# Altium schematic sheet eMMC.SchDoc
size 420 x 297 mm; SheetNumber: 14; SheetTotal: 34
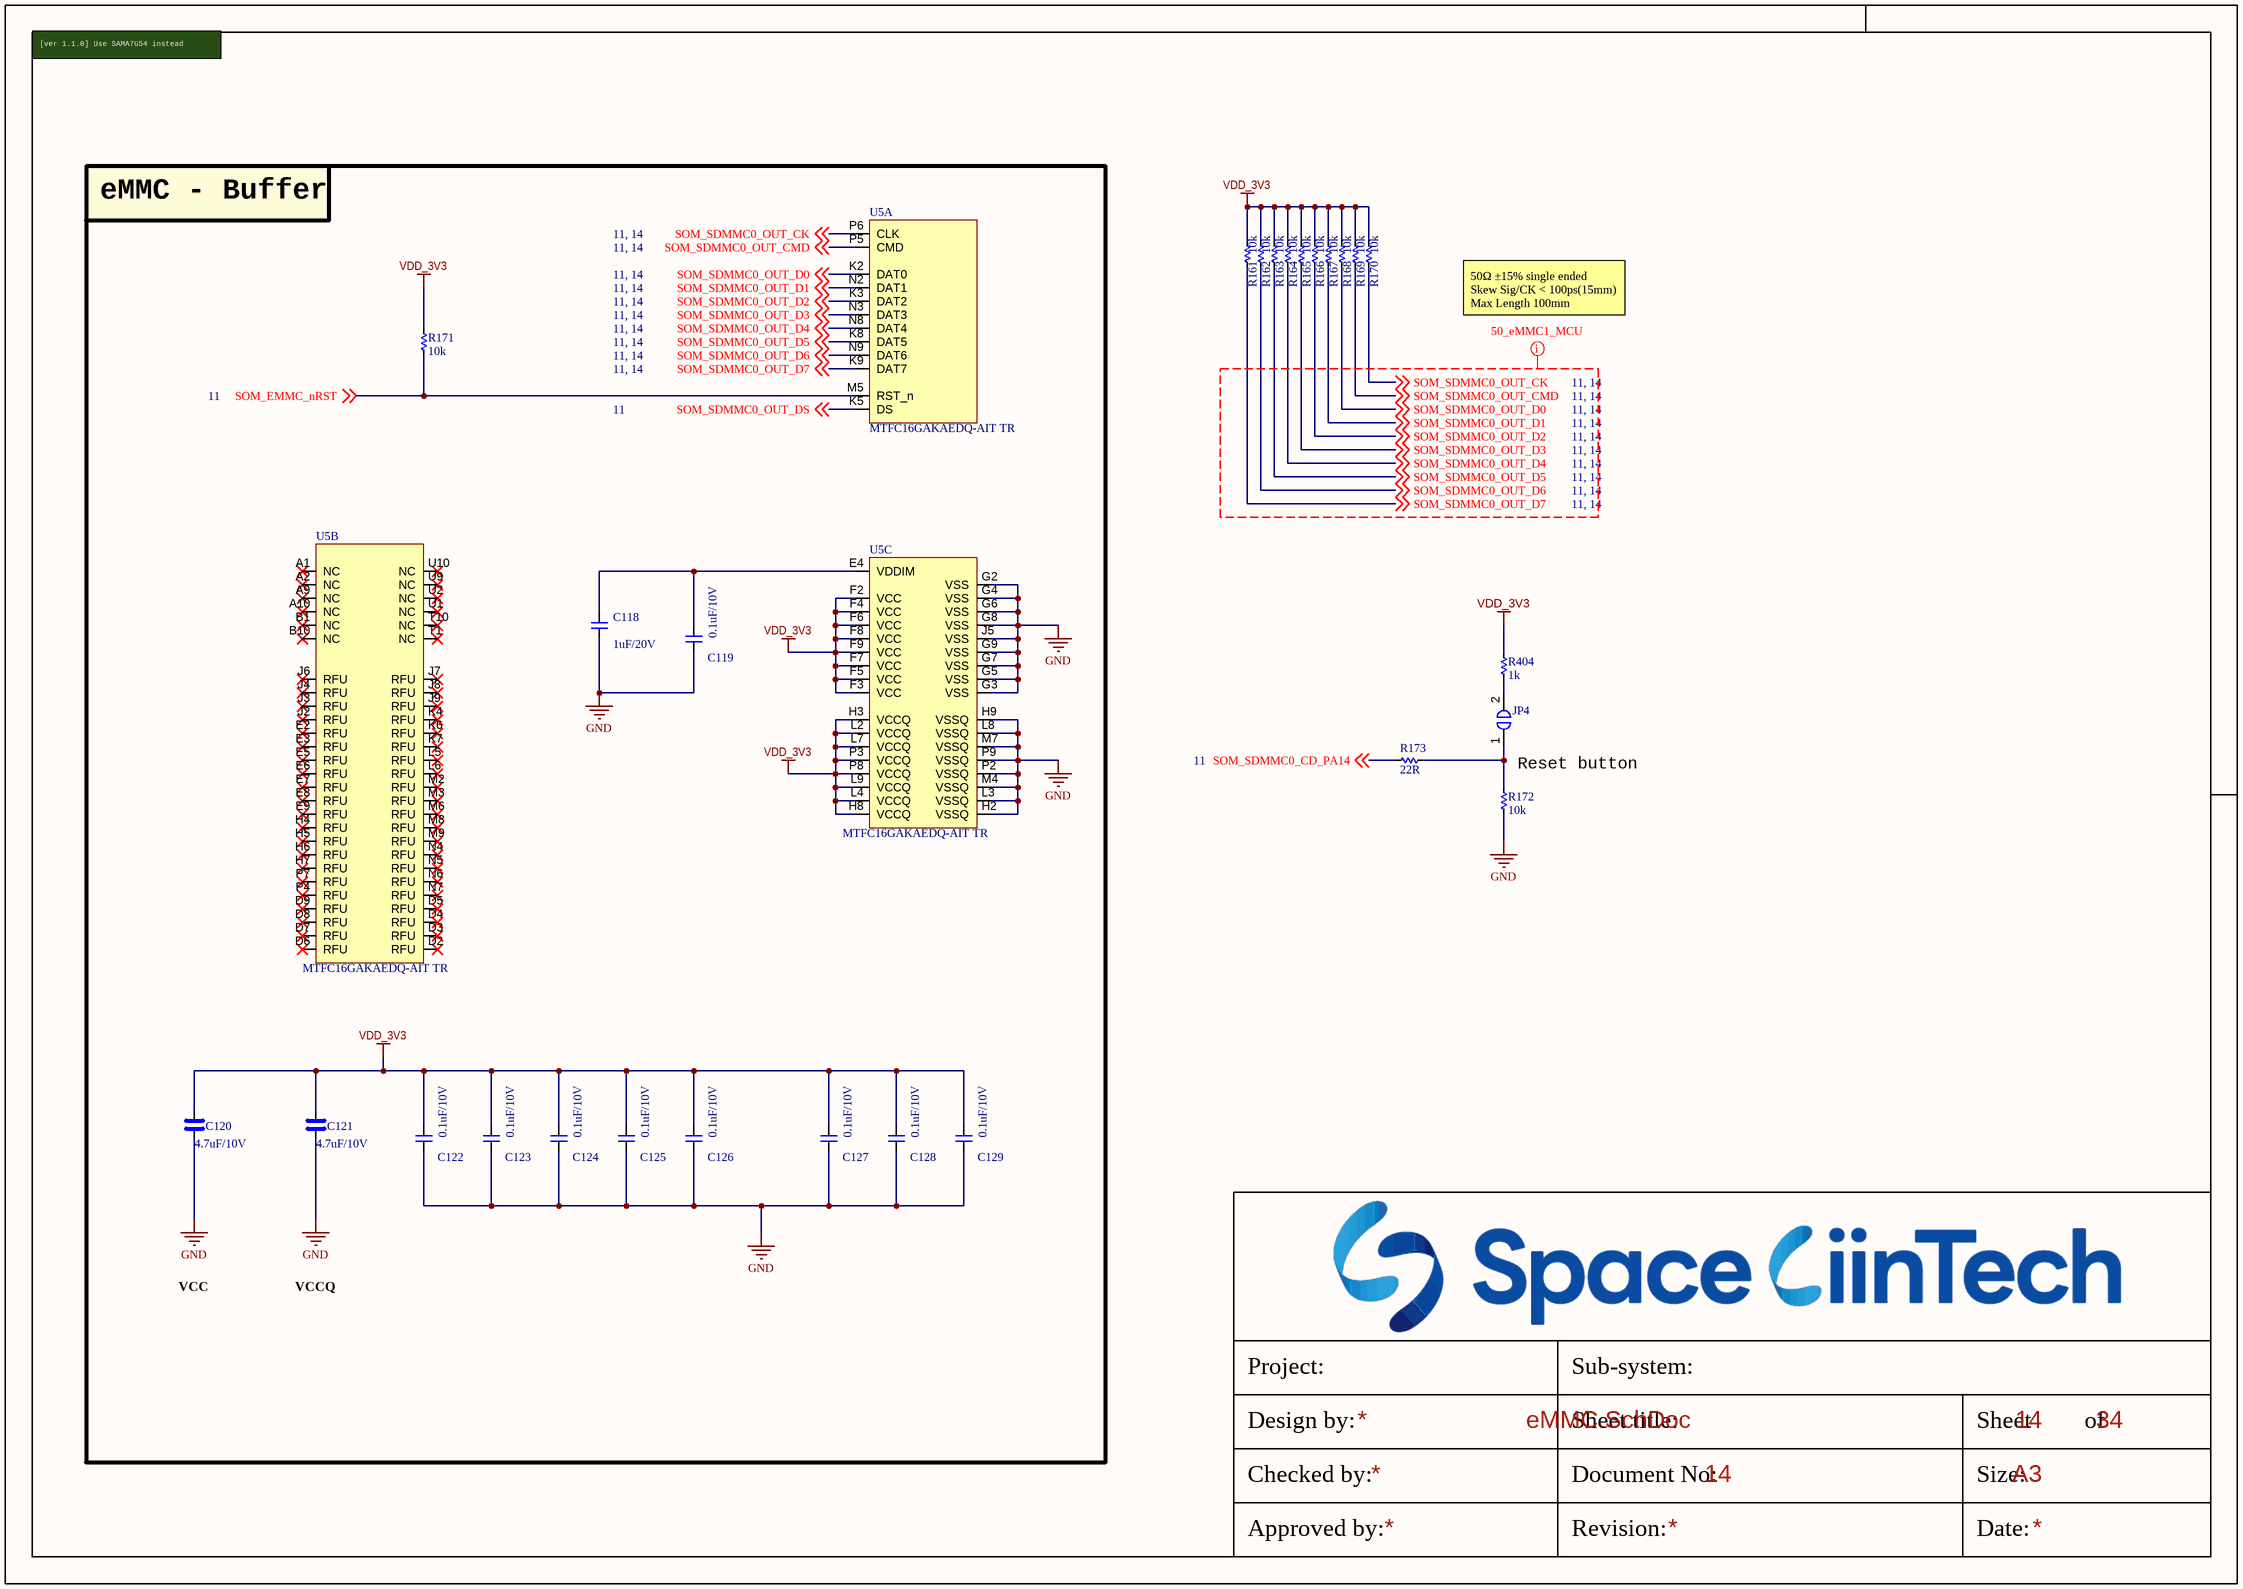
[diagram p0: eMMC.SchDoc]

## Parts
C118  1uF/20V  [CAP_C_1005X50_L]
C119  0.1uF/10V  [CAP_C_1005X50_L]
C120  4.7uF/10V  [CAP_C_1005X50_L]
C121  4.7uF/10V  [CAP_C_1005X50_L]
C122  0.1uF/10V  [CAP_C_1005X50_L]
C123  0.1uF/10V  [CAP_C_1005X50_L]
C124  0.1uF/10V  [CAP_C_1005X50_L]
C125  0.1uF/10V  [CAP_C_1005X50_L]
C126  0.1uF/10V  [CAP_C_1005X50_L]
C127  0.1uF/10V  [CAP_C_1005X50_L]
C128  0.1uF/10V  [CAP_C_1005X50_L]
C129  0.1uF/10V  [CAP_C_1005X50_L]
JP4  (no value)  [JUMPER_1608]
R161  10k  [RES_C_1005x30_L]
R162  10k  [RES_C_1005x30_L]
R163  10k  [RES_C_1005x30_L]
R164  10k  [RES_C_1005x30_L]
R165  10k  [RES_C_1005x30_L]
R166  10k  [RES_C_1005x30_L]
R167  10k  [RES_C_1005x30_L]
R168  10k  [RES_C_1005x30_L]
R169  10k  [RES_C_1005x30_L]
R170  10k  [RES_C_1005x30_L]
R171  10k  [RES_C_1005x30_L]
R172  10k  [RES_C_1005x30_L]
R173  22R  [RES_C_1005x30_L]
R404  1k  [RES_C_1005x30_L]
U5  MTFC16GAKAEDQ-AIT TR  [BGA_100_C_100P_10X17_1400X1800X150]  (parts A,B,C of 3)

## Blocks framed on the sheet
eMMC - Buffer: C118-C129 R171 U5

## Nets
GND: C118.1 C119.1 C120.1 C121.1 C122.1 C123.1 C124.1 C125.1 C126.1 C127.1 C128.1 C129.1 R172.1 U5.G2(VSS) U5.G3(VSS) U5.G4(VSS) U5.G5(VSS) U5.G6(VSS) U5.G7(VSS) U5.G8(VSS) U5.G9(VSS) U5.H2(VSSQ) U5.H9(VSSQ) U5.J5(VSS) U5.L3(VSSQ) U5.L8(VSSQ) U5.M4(VSSQ) U5.M7(VSSQ) U5.P2(VSSQ) U5.P9(VSSQ)
VDD_3V3: C120.2 C121.2 C122.2 C123.2 C124.2 C125.2 C126.2 C127.2 C128.2 C129.2 R161.2 R162.2 R163.2 R164.2 R165.2 R166.2 R167.2 R168.2 R169.2 R170.2 R171.2 R404.2 U5.F2(VCC) U5.F3(VCC) U5.F4(VCC) U5.F5(VCC) U5.F6(VCC) U5.F7(VCC) U5.F8(VCC) U5.F9(VCC) U5.H3(VCCQ) U5.H8(VCCQ) U5.L2(VCCQ) U5.L4(VCCQ) U5.L7(VCCQ) U5.L9(VCCQ) U5.P3(VCCQ) U5.P8(VCCQ)
SOM_EMMC_nRST: R171.1 U5.M5(RST_n) ; off-sheet SOM_EMMC_nRST
SOM_SDMMC0_CD_PA14: R173.1 ; off-sheet SOM_SDMMC0_CD_PA14
SOM_SDMMC0_OUT_CK: R170.1 U5.P6(CLK) ; off-sheet SOM_SDMMC0_OUT_CK
SOM_SDMMC0_OUT_CMD: R169.1 U5.P5(CMD) ; off-sheet SOM_SDMMC0_OUT_CMD
SOM_SDMMC0_OUT_D0: R168.1 U5.K2(DAT0) ; off-sheet SOM_SDMMC0_OUT_D0
SOM_SDMMC0_OUT_D1: R167.1 U5.N2(DAT1) ; off-sheet SOM_SDMMC0_OUT_D1
SOM_SDMMC0_OUT_D2: R166.1 U5.K3(DAT2) ; off-sheet SOM_SDMMC0_OUT_D2
SOM_SDMMC0_OUT_D3: R165.1 U5.N3(DAT3) ; off-sheet SOM_SDMMC0_OUT_D3
SOM_SDMMC0_OUT_D4: R164.1 U5.N8(DAT4) ; off-sheet SOM_SDMMC0_OUT_D4
SOM_SDMMC0_OUT_D5: R163.1 U5.K8(DAT5) ; off-sheet SOM_SDMMC0_OUT_D5
SOM_SDMMC0_OUT_D6: R162.1 U5.N9(DAT6) ; off-sheet SOM_SDMMC0_OUT_D6
SOM_SDMMC0_OUT_D7: R161.1 U5.K9(DAT7) ; off-sheet SOM_SDMMC0_OUT_D7
SOM_SDMMC0_OUT_DS: U5.K5(DS) ; off-sheet SOM_SDMMC0_OUT_DS
NetC118_2: C118.2 C119.2 U5.E4(VDDIM)
NetJP4_1: JP4.1 R172.2 R173.2
NetJP4_2: JP4.2 R404.1

Not connected (* = marked no-connect by the designer): U5 A1(NC)* A2(NC)* A9(NC)* A10(NC)* B1(NC)* B10(NC)* D2(RFU)* D3(RFU)* D4(RFU)* D5(RFU)* D6(RFU)* D7(RFU)* D8(RFU)* D9(RFU)* E2(RFU)* E3(RFU)* E5(RFU)* E6(RFU)* E7(RFU)* E8(RFU)* E9(RFU)* H4(RFU)* H5(RFU)* H6(RFU)* H7(RFU)* J2(RFU)* J3(RFU)* J4(RFU)* J6(RFU)* J7(RFU)* J8(RFU)* J9(RFU)* K4(RFU)* K6(RFU)* K7(RFU)* L5(RFU)* L6(RFU)* M2(RFU)* M3(RFU)* M6(RFU)* M8(RFU)* M9(RFU)* N4(RFU)* N5(RFU)* N6(RFU)* N7(RFU)* P4(RFU)* P7(RFU)* T1(NC)* T10(NC)* U1(NC)* U2(NC)* U9(NC)* U10(NC)*

## Layout directives
net class 50_eMMC1_MCU: SOM_SDMMC0_OUT_CK, SOM_SDMMC0_OUT_CMD, SOM_SDMMC0_OUT_D0, SOM_SDMMC0_OUT_D1, SOM_SDMMC0_OUT_D2, SOM_SDMMC0_OUT_D3, SOM_SDMMC0_OUT_D4, SOM_SDMMC0_OUT_D5, SOM_SDMMC0_OUT_D6, SOM_SDMMC0_OUT_D7

## Notes on the sheet
- [ver 1.1.0] Use SAMA7G54 instead
- 50Ω ±15% single ended
  Skew Sig/CK < 100ps(15mm)
  Max Length 100mm
- Reset button
- VCC
- VCCQ
- Project:
- Sub-system:
- Design by:
- Sheet title:
- Sheet
- of
- Checked by:
- Approved by:
- Revision:
- Document No:
- Size:
- Date:
- A3

## Library data of the parts
C118 = _CAP_C_2: CAP CHIP
C119 C122-C129 = _CAP_C_2: CAP
C120 C121 = _CAP_C_High_2: CAP
JP4 = JUMPER_1_1
R161-R173 R404 = _RES_B_2: RES
U5 = IC_eMMC_MTFC16GAKAEDQ-AIT TR